# Altium schematic sheet 单片机.SchDoc
size C
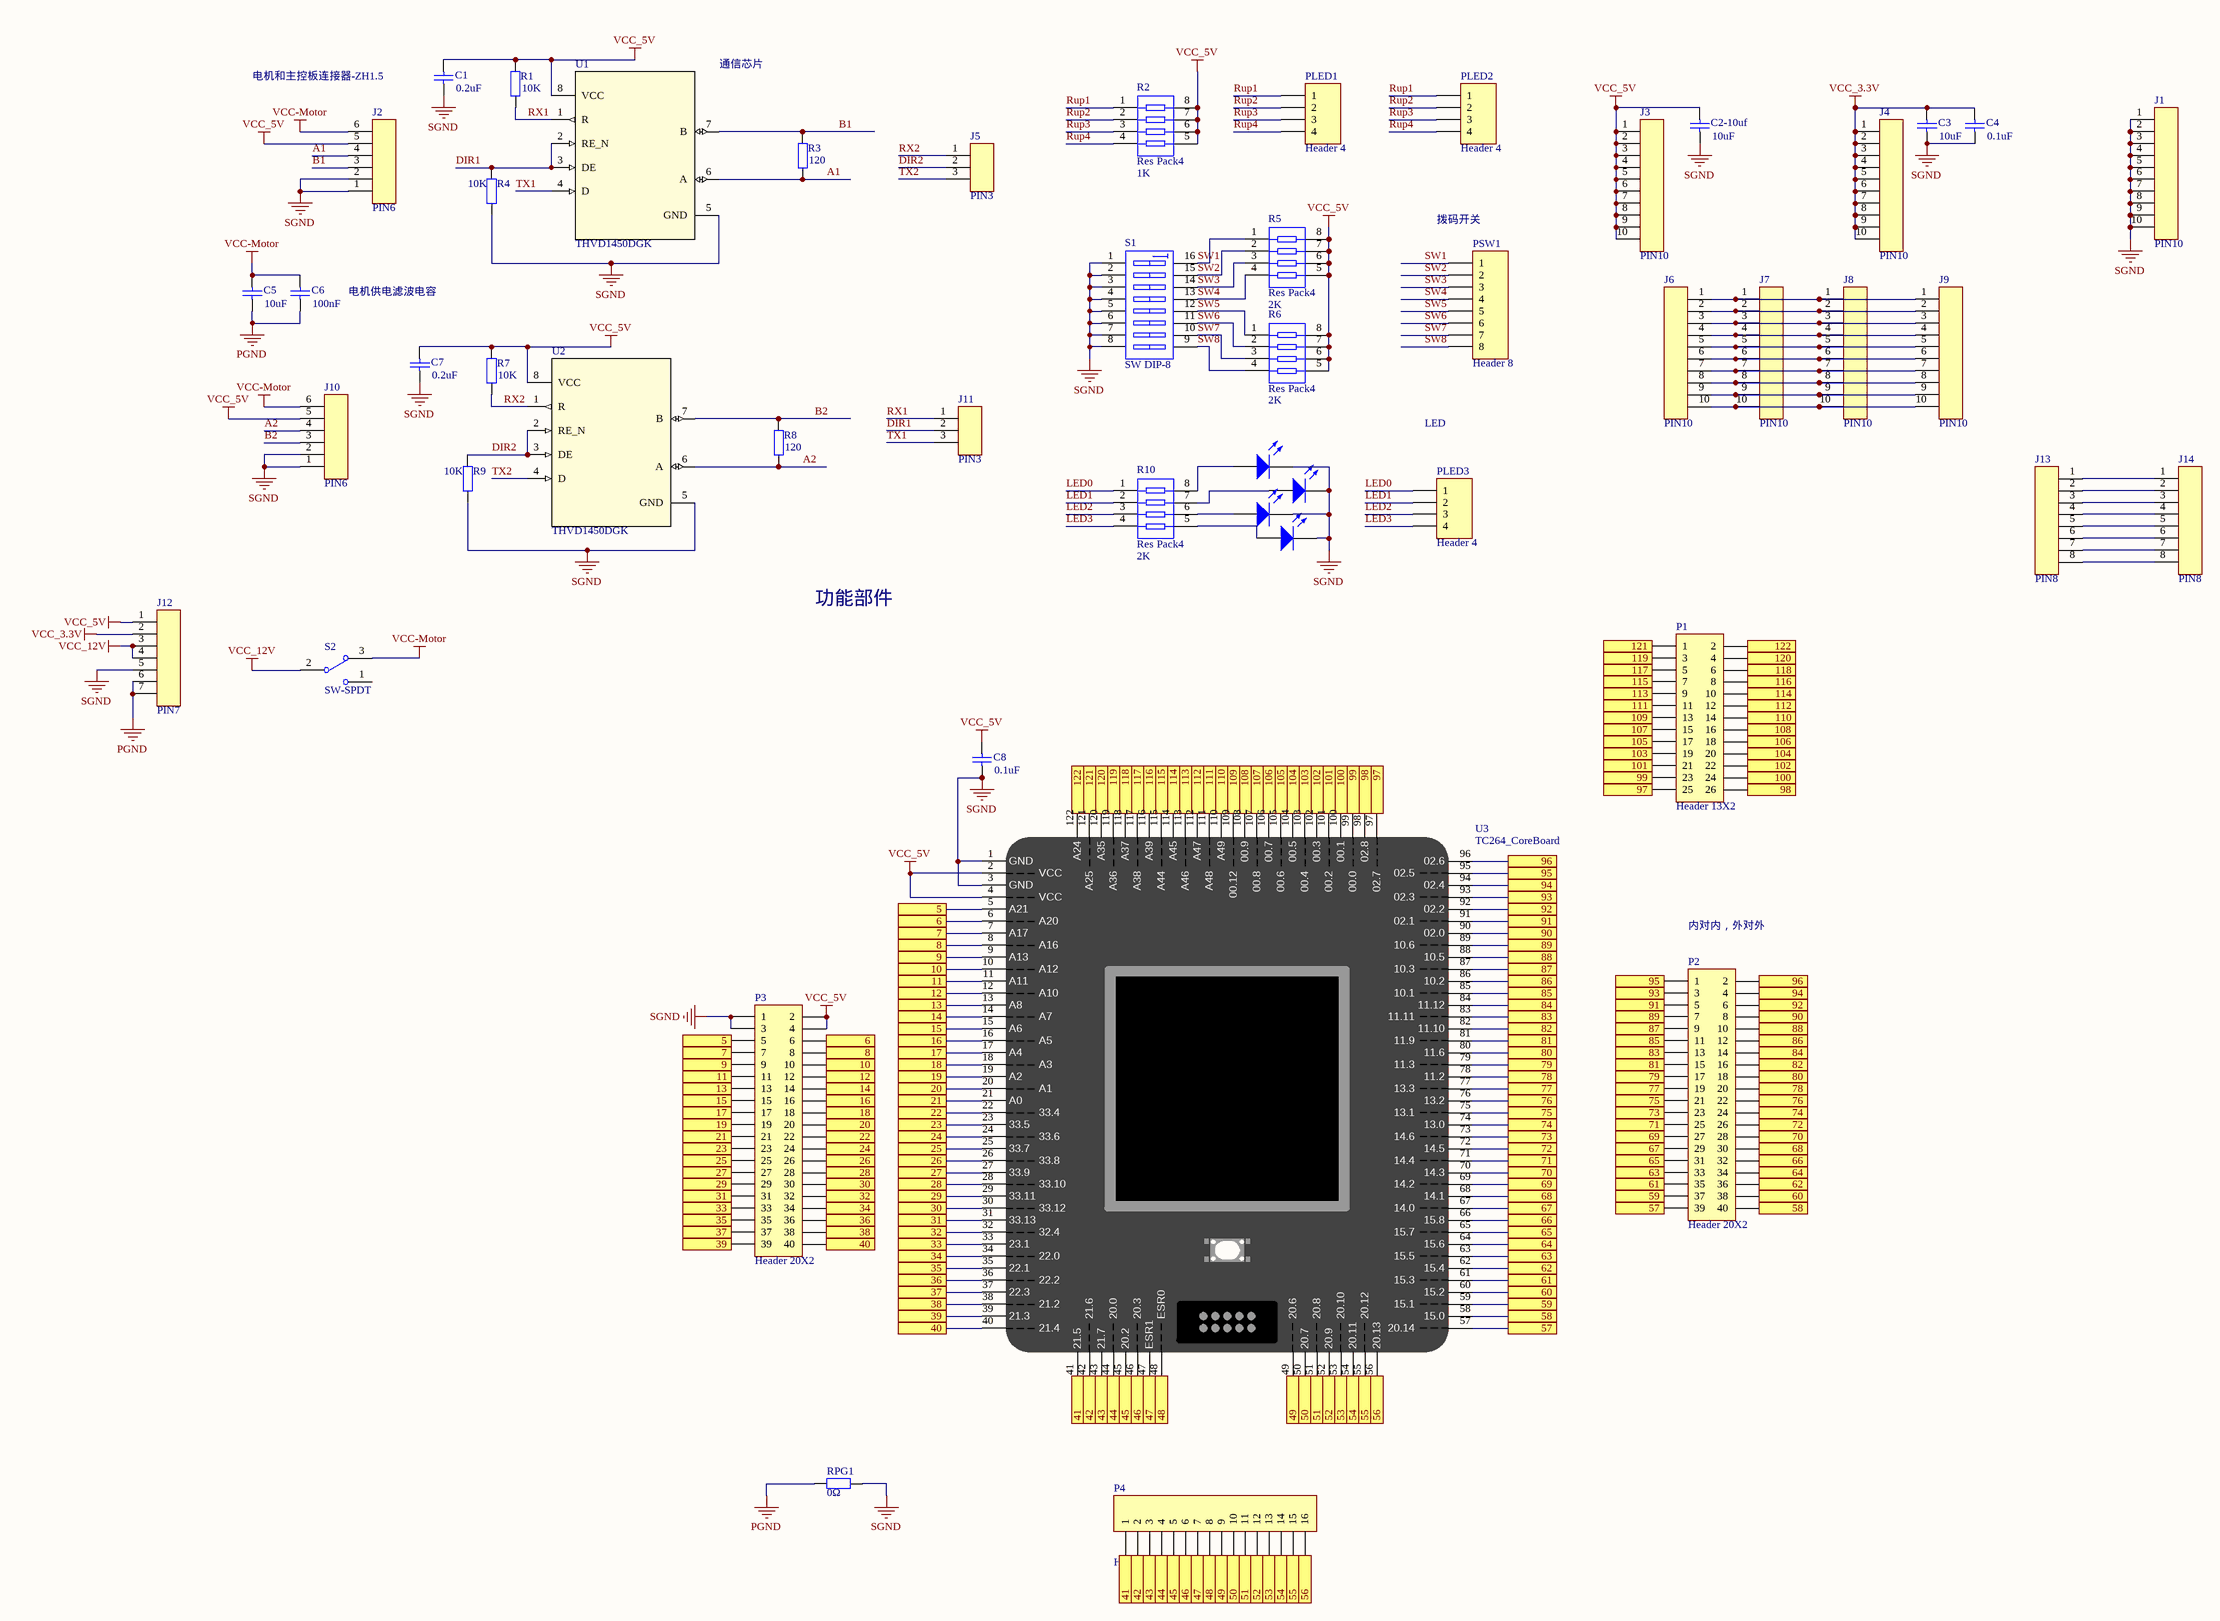
[diagram p0: 单片机.SchDoc]

## Parts
C1  value 0.2uF  [C0805]  (hidden comment: Cap)
C2-10uf  value 10uF  [C0805]  (hidden comment: Cap)
C3  value 10uF  [C0805]  (hidden comment: Cap)
C4  value 0.1uF  [C0805]  (hidden comment: Cap)
C5  value 10uF  [C0805]  (hidden comment: Cap)
C6  value 100nF  [C0805]  (hidden comment: Cap)
C7  value 0.2uF  [C0805]  (hidden comment: Cap)
C8  value 0.1uF  [C0805]  (hidden comment: Cap)
D1  LED0  [LED0805]  (value not drawn)
D2  LED0  [LED0805]  (value not drawn)
D3  LED0  [LED0805]  (value not drawn)
D4  LED0  [LED0805]  (value not drawn)
J1  PIN10  [SIP10]
J2  PIN6  [ZH1.5-LI-6P]
J3  PIN10  [SIP10]
J4  PIN10  [SIP10]
J5  PIN3  [SIP3]
J6  PIN10  [SIP10]
J7  PIN10  [SIP10]
J8  PIN10  [SIP10]
J9  PIN10  [SIP10]
J10  PIN6  [ZH1.5-LI-6P]
J11  PIN3  [SIP3]
J12  PIN7  [XH7-2.54]
J13  PIN8  [SIP8]
J14  PIN8  [SIP8]
P1  Header 13X2  [HDR2X13]
P2  Header 20X2  [HDR2X20]
P3  Header 20X2  [HDR2X20]
P4  Header 16  [HDR1X16]
PLED1  Header 4  [HDR1X4]
PLED2  Header 4  [HDR1X4]
PLED3  Header 4  [HDR1X4]
PSW1  Header 8  [HDR1X8]
R1  value 10K  [R0603]  (hidden comment: Res2)
R2  Res Pack4  value 1K  [R0603 组排]
R3  value 120  [R0603]  (hidden comment: Res2)
R4  value 10K  [R0603]  (hidden comment: Res2)
R5  Res Pack4  value 2K  [R0603 组排]
R6  Res Pack4  value 2K  [R0603 组排]
R7  value 10K  [R0603]  (hidden comment: Res2)
R8  value 120  [R0603]  (hidden comment: Res2)
R9  value 10K  [R0603]  (hidden comment: Res2)
R10  Res Pack4  value 2K  [R0603 组排]
RPG1  value 0Ω  [R1206]  (hidden comment: Res2)
S1  SW DIP-8  [DIP_SW_8WAY_SMD]
S2  SW-SPDT  [SW-TO3]
U1  THVD1450DGK  [DGK0008A_N]
U2  THVD1450DGK  [DGK0008A_N]
U3  TC264_CoreBoard  [TC264_CoreBoard]

## Ports
5, 6, 7, 8, 9, 10, 11, 12, 13, 14, 15, 16, 17, 18, 19, 20, 21, 22, 23, 24, 25, 26, 27, 28, 29, 30, 31, 32, 33, 34, 35, 36, 37, 38, 39, 40, 41, 42, 43, 44, 45, 46, 47, 48, 49, 50, 51, 52, 53, 54, 55, 56, 57, 58, 59, 60, 61, 62, 63, 64, 65, 66, 67, 68, 69, 70, 71, 72, 73, 74, 75, 76, 77, 78, 79, 80, 81, 82, 83, 84, 85, 86, 87, 88, 89, 90, 91, 92, 93, 94, 95, 96, 97, 98, 99, 100, 101, 102, 103, 104, 105, 106, 107, 108, 109, 110, 111, 112, 113, 114, 115, 116, 117, 118, 119, 120, 121, 122

## Nets
PGND: C5.1 C6.1 J12.6 J12.7 RPG1.2
SGND: C1.1 C2-10uf.1 C3.1 C4.1 C7.1 C8.1 D1.2(K) D2.2(K) D3.2(K) D4.2(K) J1.1 J1.2 J1.3 J1.4 J1.5 J1.6 J1.7 J1.8 J1.9 J1.10 J2.1 J2.2 J10.1 J10.2 J12.5 P3.1 P3.3 R4.1 R9.1 RPG1.1 S1.1(A1) S1.2(A2) S1.3(A3) S1.4(A4) S1.5(A5) S1.6(A6) S1.7(A7) S1.8(A8) U1.5(GND) U2.5(GND) U3.1(GND) U3.3(GND)
VCC-Motor: C5.2 C6.2 J2.6 J10.6 S2.3
VCC_3.3V: C3.2 C4.2 J4.1 J4.2 J4.3 J4.4 J4.5 J4.6 J4.7 J4.8 J4.9 J4.10 J12.2
VCC_5V: C1.2 C2-10uf.2 C7.2 C8.2 J2.5 J3.1 J3.2 J3.3 J3.4 J3.5 J3.6 J3.7 J3.8 J3.9 J3.10 J10.5 J12.1 P3.2 P3.4 R1.2 R2.5 R2.6 R2.7 R2.8 R5.5 R5.6 R5.7 R5.8 R6.5 R6.6 R6.7 R6.8 R7.2 U1.8(VCC) U2.8(VCC) U3.2(VCC) U3.4(VCC)
VCC_12V: J12.3 J12.4 S2.2
5: P3.5 U3.5(A21) ; port 5
6: P3.6 U3.6(A20) ; port 6
7: P3.7 U3.7(A17) ; port 7
8: P3.8 U3.8(A16) ; port 8
9: P3.9 U3.9(A13) ; port 9
10: P3.10 U3.10(A12) ; port 10
11: P3.11 U3.11(A11) ; port 11
12: P3.12 U3.12(A10) ; port 12
13: P3.13 U3.13(A8) ; port 13
14: P3.14 U3.14(A7) ; port 14
15: P3.15 U3.15(A6) ; port 15
16: P3.16 U3.16(A5) ; port 16
17: P3.17 U3.17(A4) ; port 17
18: P3.18 U3.18(A3) ; port 18
19: P3.19 U3.19(A2) ; port 19
20: P3.20 U3.20(A1) ; port 20
21: P3.21 U3.21(A0) ; port 21
22: P3.22 U3.22(33.4) ; port 22
23: P3.23 U3.23(33.5) ; port 23
24: P3.24 U3.24(33.6) ; port 24
25: P3.25 U3.25(33.7) ; port 25
26: P3.26 U3.26(33.8) ; port 26
27: P3.27 U3.27(33.9) ; port 27
28: P3.28 U3.28(33.10) ; port 28
29: P3.29 U3.29(33.11) ; port 29
30: P3.30 U3.30(33.12) ; port 30
31: P3.31 U3.31(33.13) ; port 31
32: P3.32 U3.32(32.4) ; port 32
33: P3.33 U3.33(23.1) ; port 33
34: P3.34 U3.34(22.0) ; port 34
35: P3.35 U3.35(22.1) ; port 35
36: P3.36 U3.36(22.2) ; port 36
37: P3.37 U3.37(22.3) ; port 37
38: P3.38 U3.38(21.2) ; port 38
39: P3.39 U3.39(21.3) ; port 39
40: P3.40 U3.40(21.4) ; port 40
41: P4.1 U3.41(21.5) ; port 41
42: P4.2 U3.42(21.6) ; port 42
43: P4.3 U3.43(21.7) ; port 43
44: P4.4 U3.44(20.0) ; port 44
45: P4.5 U3.45(20.2) ; port 45
46: P4.6 U3.46(20.3) ; port 46
47: P4.7 U3.47(ESR1) ; port 47
48: P4.8 U3.48(ESR0) ; port 48
49: P4.9 U3.49(20.6) ; port 49
50: P4.10 U3.50(20.7) ; port 50
51: P4.11 U3.51(20.8) ; port 51
52: P4.12 U3.52(20.9) ; port 52
53: P4.13 U3.53(20.10) ; port 53
54: P4.14 U3.54(20.11) ; port 54
55: P4.15 U3.55(20.12) ; port 55
56: P4.16 U3.56(20.13) ; port 56
57: P2.39 U3.57(20.14) ; port 57
58: P2.40 U3.58(15.0) ; port 58
59: P2.37 U3.59(15.1) ; port 59
60: P2.38 U3.60(15.2) ; port 60
61: P2.35 U3.61(15.3) ; port 61
62: P2.36 U3.62(15.4) ; port 62
63: P2.33 U3.63(15.5) ; port 63
64: P2.34 U3.64(15.6) ; port 64
65: P2.31 U3.65(15.7) ; port 65
66: P2.32 U3.66(15.8) ; port 66
67: P2.29 U3.67(14.0) ; port 67
68: P2.30 U3.68(14.1) ; port 68
69: P2.27 U3.69(14.2) ; port 69
70: P2.28 U3.70(14.3) ; port 70
71: P2.25 U3.71(14.4) ; port 71
72: P2.26 U3.72(14.5) ; port 72
73: P2.23 U3.73(14.6) ; port 73
74: P2.24 U3.74(13.0) ; port 74
75: P2.21 U3.75(13.1) ; port 75
76: P2.22 U3.76(13.2) ; port 76
77: P2.19 U3.77(13.3) ; port 77
78: P2.20 U3.78(11.2) ; port 78
79: P2.17 U3.79(11.3) ; port 79
80: P2.18 U3.80(11.6) ; port 80
81: P2.15 U3.81(11.9) ; port 81
82: P2.16 U3.82(11.10) ; port 82
83: P2.13 U3.83(11.11) ; port 83
84: P2.14 U3.84(11.12) ; port 84
85: P2.11 U3.85(10.1) ; port 85
86: P2.12 U3.86(10.2) ; port 86
87: P2.9 U3.87(10.3) ; port 87
88: P2.10 U3.88(10.5) ; port 88
89: P2.7 U3.89(10.6) ; port 89
90: P2.8 U3.90(02.0) ; port 90
91: P2.5 U3.91(02.1) ; port 91
92: P2.6 U3.92(02.2) ; port 92
93: P2.3 U3.93(02.3) ; port 93
94: P2.4 U3.94(02.4) ; port 94
95: P2.1 U3.95(02.5) ; port 95
96: P2.2 U3.96(02.6) ; port 96
97: P1.25 U3.97(02.7) ; port 97
98: P1.26 U3.98(02.8) ; port 98
99: P1.23 U3.99(00.0) ; port 99
100: P1.24 U3.100(00.1) ; port 100
101: P1.21 U3.101(00.2) ; port 101
102: P1.22 U3.102(00.3) ; port 102
103: P1.19 U3.103(00.4) ; port 103
104: P1.20 U3.104(00.5) ; port 104
105: P1.17 U3.105(00.6) ; port 105
106: P1.18 U3.106(00.7) ; port 106
107: P1.15 U3.107(00.8) ; port 107
108: P1.16 U3.108(00.9) ; port 108
109: P1.13 U3.109(00.12) ; port 109
110: P1.14 U3.110(A49) ; port 110
111: P1.11 U3.111(A48) ; port 111
112: P1.12 U3.112(A47) ; port 112
113: P1.9 U3.113(A46) ; port 113
114: P1.10 U3.114(A45) ; port 114
115: P1.7 U3.115(A44) ; port 115
116: P1.8 U3.116(A39) ; port 116
117: P1.5 U3.117(A38) ; port 117
118: P1.6 U3.118(A37) ; port 118
119: P1.3 U3.119(A36) ; port 119
120: P1.4 U3.120(A35) ; port 120
121: P1.1 U3.121(A25) ; port 121
122: P1.2 U3.122(A24) ; port 122
A1: J2.4 R3.1 U1.6(A)
A2: J10.4 R8.1 U2.6(A)
B1: J2.3 R3.2 U1.7(B)
B2: J10.3 R8.2 U2.7(B)
DIR1: J11.2 R4.2 U1.2(RE_N) U1.3(DE)
DIR2: J5.2 R9.2 U2.2(RE_N) U2.3(DE)
LED0: PLED3.1 R10.1
LED1: PLED3.2 R10.2
LED2: PLED3.3 R10.3
LED3: PLED3.4 R10.4
Rup1: PLED1.1 PLED2.1 R2.1
Rup2: PLED1.2 PLED2.2 R2.2
Rup3: PLED1.3 PLED2.3 R2.3
Rup4: PLED1.4 PLED2.4 R2.4
RX1: J11.1 R1.1 U1.1(R)
RX2: J5.1 R7.1 U2.1(R)
SW1: PSW1.1 R5.1 S1.16(B1)
SW2: PSW1.2 R5.2 S1.15(B2)
SW3: PSW1.3 R5.3 S1.14(B3)
SW4: PSW1.4 R5.4 S1.13(B4)
SW5: PSW1.5 R6.1 S1.12(B5)
SW6: PSW1.6 R6.2 S1.11(B6)
SW7: PSW1.7 R6.3 S1.10(B7)
SW8: PSW1.8 R6.4 S1.9(B8)
TX1: J11.3 U1.4(D)
TX2: J5.3 U2.4(D)
NetD1_1: D1.1(A) R10.8
NetD2_1: D2.1(A) R10.7
NetD3_1: D3.1(A) R10.6
NetD4_1: D4.1(A) R10.5
NetJ6_1: J6.1 J7.1 J8.1 J9.1
NetJ6_2: J6.2 J7.2 J8.2 J9.2
NetJ6_3: J6.3 J7.3 J8.3 J9.3
NetJ6_4: J6.4 J7.4 J8.4 J9.4
NetJ6_5: J6.5 J7.5 J8.5 J9.5
NetJ6_6: J6.6 J7.6 J8.6 J9.6
NetJ6_7: J6.7 J7.7 J8.7 J9.7
NetJ6_8: J6.8 J7.8 J8.8 J9.8
NetJ6_9: J6.9 J7.9 J8.9 J9.9
NetJ6_10: J6.10 J7.10 J8.10 J9.10
NetJ13_1: J13.1 J14.1
NetJ13_2: J13.2 J14.2
NetJ13_3: J13.3 J14.3
NetJ13_4: J13.4 J14.4
NetJ13_5: J13.5 J14.5
NetJ13_6: J13.6 J14.6
NetJ13_7: J13.7 J14.7
NetJ13_8: J13.8 J14.8

Not connected (* = marked no-connect by the designer): S2 1

## Notes on the sheet
- 电机和主控板连接器-ZH1.5
- (near U1) 通信芯片
- (near PSW1) 拨码开关
- 电机供电滤波电容
- LED
- 功能部件
- 内对内，外对外
- Title
- Size:
- Date:
- File:
- C
- Number:
- Time:
- Revision:
- Sheet
- of

## Library data of the parts
C1 C2-10uf C3-C8 = Cap: Capacitor; Published: 8-Jun-2000; LatestRevisionDate: 17-Jul-2002; LatestRevisionNote: Re-released for DXP Platform.; PackageReference: RAD-0.3; Publisher: Altium Limited; PackageDescription: Radial Cap, Thru-Hole; 2 Leads; 0.3 in Pin Spacing
D1-D4 = LED0: Typical INFRARED GaAs LED; Published: 8-Jun-2000; LatestRevisionDate: 08-Jul-2005; LatestRevisionNote: Mech Layer 1 removed.; PackageReference: LED-0; Publisher: Altium Limited; PackageDescription: LED; 2 Leads
P1 = Header 13X2: Header, 13-Pin, Dual row; LatestRevisionDate: 17-Jul-2002; LatestRevisionNote: Re-released for DXP Platform.; Publisher: Altium Limited
P2 P3 = Header 20X2: Header, 20-Pin, Dual row; LatestRevisionDate: 17-Jul-2002; LatestRevisionNote: Re-released for DXP Platform.; Publisher: Altium Limited
P4 = Header 16: Header, 16-Pin; LatestRevisionDate: 17-Jul-2002; LatestRevisionNote: Re-released for DXP Platform.; Publisher: Altium Limited
PLED1-PLED3 = Header 4: Header, 4-Pin; LatestRevisionDate: 17-Jul-2002; LatestRevisionNote: Re-released for DXP Platform.; Publisher: Altium Limited
PSW1 = Header 8: Header, 8-Pin; LatestRevisionDate: 17-Jul-2002; LatestRevisionNote: Re-released for DXP Platform.; Publisher: Altium Limited
R1 R3 R4 R7-R9 RPG1 = Res2: Resistor; Published: 8-Jun-2000; LatestRevisionDate: 17-Jul-2002; LatestRevisionNote: Re-released for DXP Platform.; PackageReference: AXIAL-0.4; Publisher: Altium Limited; PackageDescription: Axial Device, Thru-Hole; 2 Leads; 0.4 in Pin Spacing
R2 R5 R6 R10 = Res_x4: Isolated Resistor Network; Published: 24-Mar-1999; LatestRevisionDate: 29-May-2009; LatestRevisionNote: IPC-7351 Footprint Added.; PackageVersion: Oct-2003; PackageReference: SSOP16; Publisher: Altium Limited; PackageDescription: 16-Pin Plastic Small Outline Package 0.65 mm Pitch; Code_JEDEC: MO-150-AC; Code_IPC: SOP65P780-16
S1 = SW DIP-8: DIP Switch, 8 Position, SPST; Published: 24-Mar-1999; LatestRevisionDate: 17-Jul-2002; LatestRevisionNote: Re-released for DXP Platform.; PackageReference: DIP_SW_8WAY_SMD; Publisher: Altium Limited; PackageDescription: DIP Switch; 16 Leads
S2 = SW-SPDT: SPDT Subminiature Toggle Switch, Right Angle Mounting, Vertical Actuation; Published: 24-Mar-1999; LatestRevisionDate: 17-Dec-2003; LatestRevisionNote: Schematic revised, PCB Footprint replaced.; DatasheetVersion: 05-Dec-2000; PackageReference: TL36WW15050; Publisher: Altium Limited; PackageDescription: Switch; 4 Leads; ComponentLink1Description: Manufacturer Link; ComponentLink1URL: http://www.apem.com
U1 U2 = THVD1450DGK: No Description Available; Manufacturer: Texas Instruments; PartNumber: THVD1450DGKR; RefDes: RefDes; Type: DEV; Value: Value; Copyright: Copyright (C) 2018 Accelerated Designs. All rights reserved
U3 = TC264_CoreBoard: 逐飞科技TC264核心板